# EAGLE schematic SMIW_KLAPA_PCB (EAGLE 9.7.0)
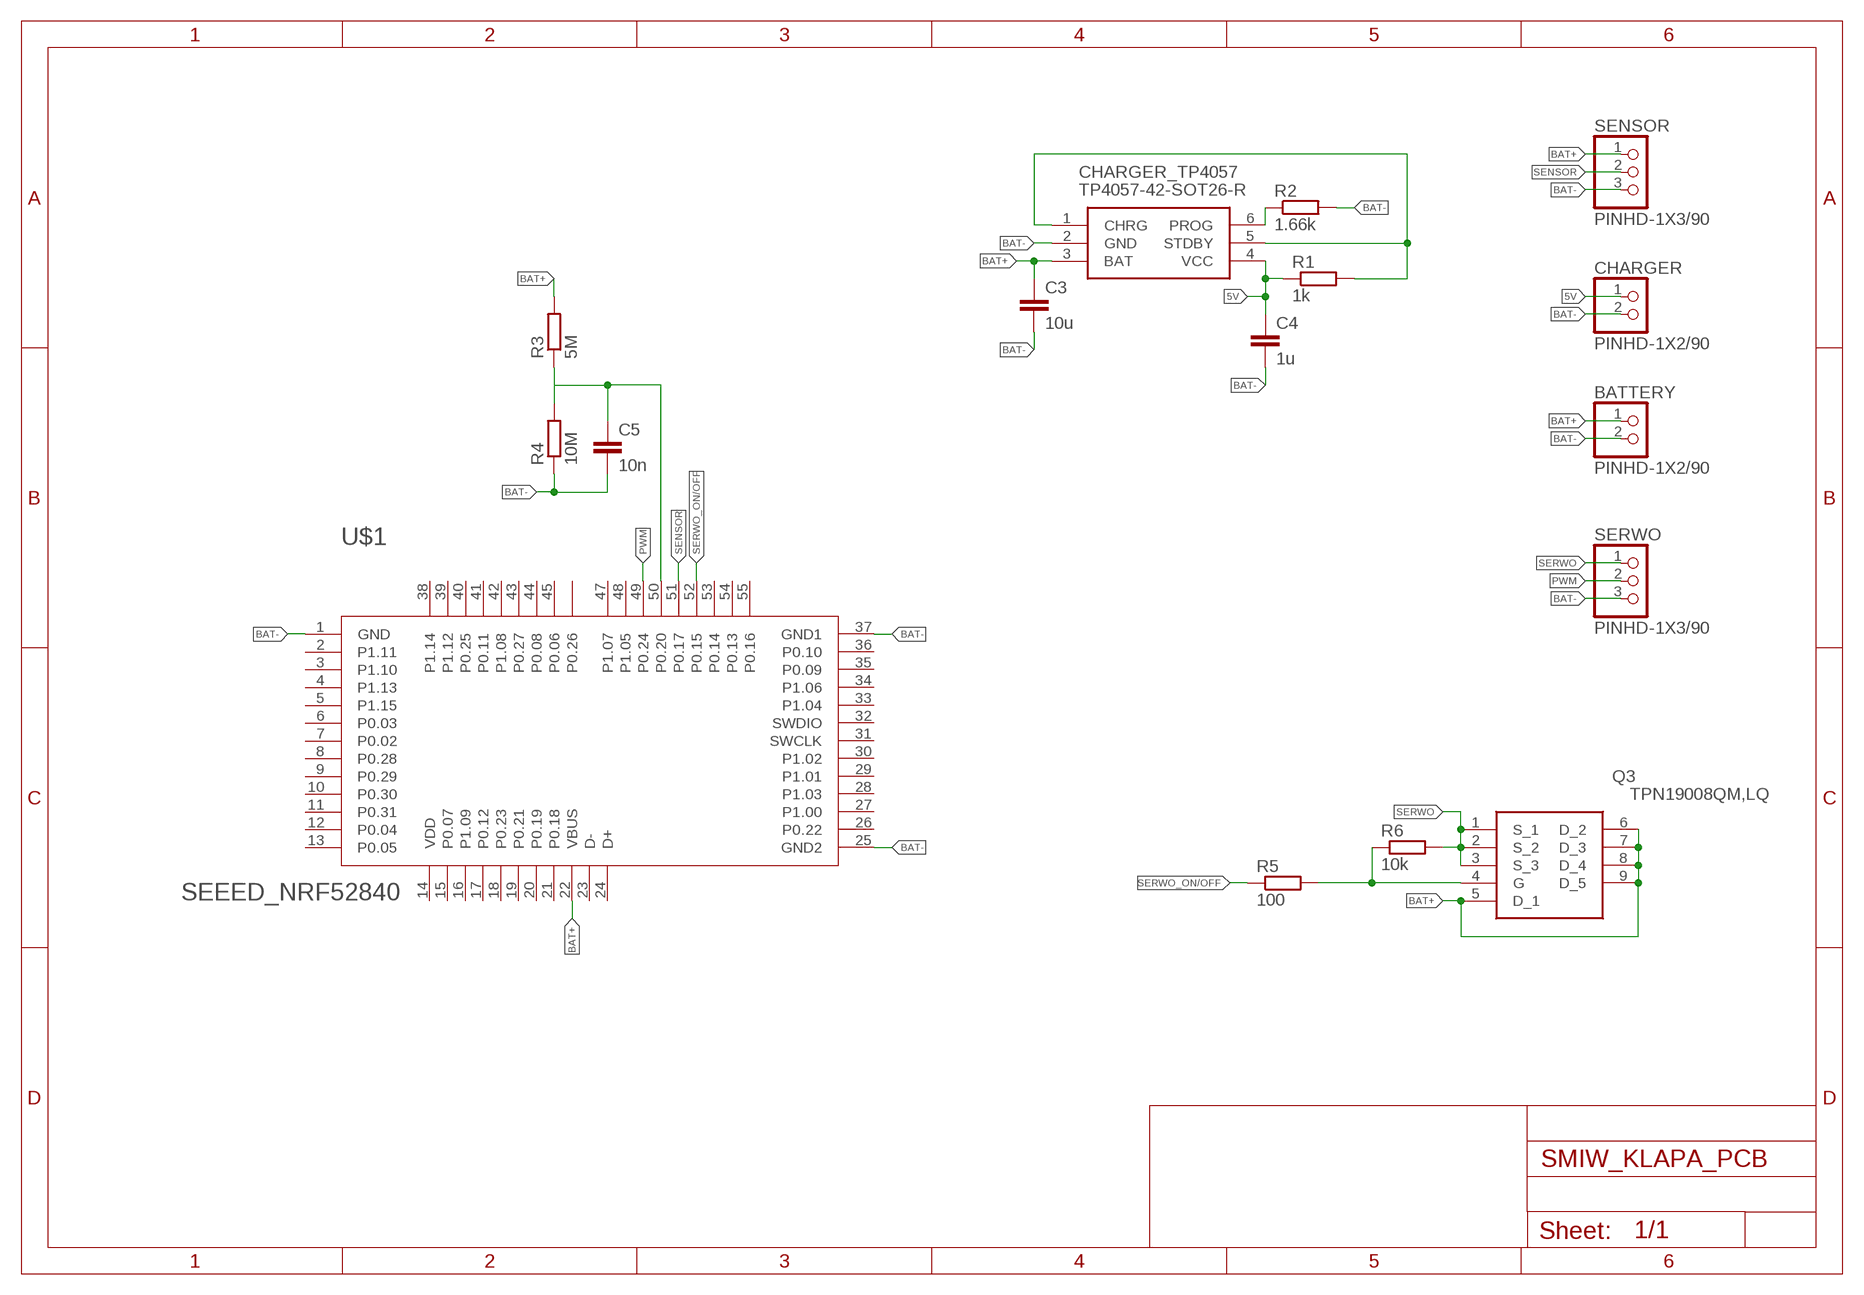
[diagram p0: schematic, sheet 1]

## Parts
BATTERY  PINHD-1X2/90  [1X02/90]
C3  10u  C-EU01005  [C01005]
C4  1u  C-EU01005  [C01005]
C5  10n  C-EU01005  [C01005]
CHARGER  PINHD-1X2/90  [1X02/90]
CHARGER_TP4057  TP4057-42-SOT26-R  [SOT95P280X125-6N]
Q3  TPN19008QM,LQ  [TPN2R304PLL1Q]
R1  1k  R-EU_01005  [R01005]
R2  1.66k  R-EU_01005  [R01005]
R3  5M  R-EU_01005  [R01005]
R4  10M  R-EU_01005  [R01005]
R5  100  R-EU_01005  [R01005]
R6  10k  R-EU_01005  [R01005]
SENSOR  PINHD-1X3/90  [1X03/90]
SERWO  PINHD-1X3/90  [1X03/90]
U$1  SEEED_NRF52840  [SEEED_NRF52840]

## Nets
5V: C4.1 CHARGER.1 CHARGER_TP4057.4(VCC) R1.1
BAT+: BATTERY.1 C3.1 CHARGER_TP4057.3(BAT) Q3.5(D_1) Q3.6(D_2) Q3.7(D_3) Q3.8(D_4) Q3.9(D_5) R3.2 SENSOR.1 U$1.22(VBUS)
BAT-: BATTERY.2 C3.2 C4.2 C5.2 CHARGER.2 CHARGER_TP4057.2(GND) R2.2 R4.1 SENSOR.3 SERWO.3 U$1.1(GND) U$1.25(GND2) U$1.37(GND1)
N$2: Q3.4(G) R5.2 R6.1
N$5: C5.1 R3.1 R4.2 U$1.7(P0.02) U$1.50(P0.20)
N$7: CHARGER_TP4057.6(PROG) R2.1
N$9: CHARGER_TP4057.1(CHRG) CHARGER_TP4057.5(STDBY) R1.2
PWM: SERWO.2 U$1.49(P0.24)
SENSOR: SENSOR.2 U$1.51(P0.17)
SERWO: Q3.1(S_1) Q3.2(S_2) Q3.3(S_3) R6.2 SERWO.1
SERWO_ON/OFF: R5.1 U$1.52(P0.15)
Unconnected: U$1.2(P1.11) U$1.3(P1.10) U$1.4(P1.13) U$1.5(P1.15) U$1.6(P0.03) U$1.8(P0.28) U$1.9(P0.29) U$1.10(P0.30) U$1.11(P0.31) U$1.12(P0.04) U$1.13(P0.05) U$1.14(VDD) U$1.15(P0.07) U$1.16(P1.09) U$1.17(P0.12) U$1.18(P0.23) U$1.19(P0.21) U$1.20(P0.19) U$1.21(P0.18) U$1.23(D-) U$1.24(D+) U$1.26(P0.22) U$1.27(P1.00) U$1.28(P1.03) U$1.29(P1.01) U$1.30(P1.02) U$1.31(SWCLK) U$1.32(SWDIO) U$1.33(P1.04) U$1.34(P1.06) U$1.35(P0.09) U$1.36(P0.10) U$1.38(P1.14) U$1.39(P1.12) U$1.40(P0.25) U$1.41(P0.11) U$1.42(P1.08) U$1.43(P0.27) U$1.44(P0.08) U$1.45(P0.06) U$1.46(P0.26) U$1.47(P1.07) U$1.48(P1.05) U$1.53(P0.14) U$1.54(P0.13) U$1.55(P0.16)

## Library data of the parts
BATTERY CHARGER = Connector:PINHD-1X2: PIN HEADER; CATEGORY: Headers; DESCRIPTION: Header, Right Angle, 2 Position; MANUFACTURER: Generic; MPN: Generic; OPERATING_TEMPERATURE: Generic; PART_STATUS: Active; PITCH: 0.100" (2.54mm); ROHS_COMPLIANCE: Generic; SERIES: Generic; SUB-CATEGORY: Headers, Male Pins; TYPE: Board to Board or Cable, Unshrouded, Through Hole, Right Angle
C3-C5 = rcl:C-EU: CAPACITOR, European symbol; SPICEPREFIX: C
CHARGER_TP4057 = SamacSys_Parts:TP4057-42-SOT26-R: PMIC - Battery Management SOT-23-6 RoHS Source: Datasheet <https://datasheet.lcsc.com/szlcsc/Nanjing-Extension-Microelectronics-TP4057_C12044.pdf>; DESCRIPTION: PMIC - Battery Management SOT-23-6 RoHS; HEIGHT: 1.25mm; MANUFACTURER_NAME: Nanjing Extension Microelectronics; MANUFACTURER_PART_NUMBER: TP4057-42-SOT26-R
Q3 = SamacSys_Parts:TPN19008QM,LQ: MOSFET PD=57W F=1MHZ Source: Datasheet <https://www.mouser.com/datasheet/2/408/TPN19008QM_datasheet_en_20191021-1815473.pdf>; DESCRIPTION: MOSFET PD=57W F=1MHZ; HEIGHT: 1mm; MANUFACTURER_NAME: Toshiba; MANUFACTURER_PART_NUMBER: TPN19008QM,LQ
R1-R6 = rcl:R-EU_: RESISTOR, European symbol; SPICEPREFIX: R
SENSOR SERWO = Connector:PINHD-1X3: PIN HEADER; CATEGORY: Headers; DESCRIPTION: Header, Right Angle, 3 Position; MANUFACTURER: Generic; MPN: Generic; OPERATING_TEMPERATURE: Generic; PART_STATUS: Active; PITCH: 0.100" (2.54mm); ROHS_COMPLIANCE: Generic; SERIES: Generic; SUB-CATEGORY: Headers, Male Pins; TYPE: Board to Board or Cable, Unshrouded, Through Hole, Right Angle
U$1 = seeed 113990556:SEEED_NRF52840